# EAGLE design UART_Splitter (EAGLE 8.0.1)

## Sheet 1 of 2
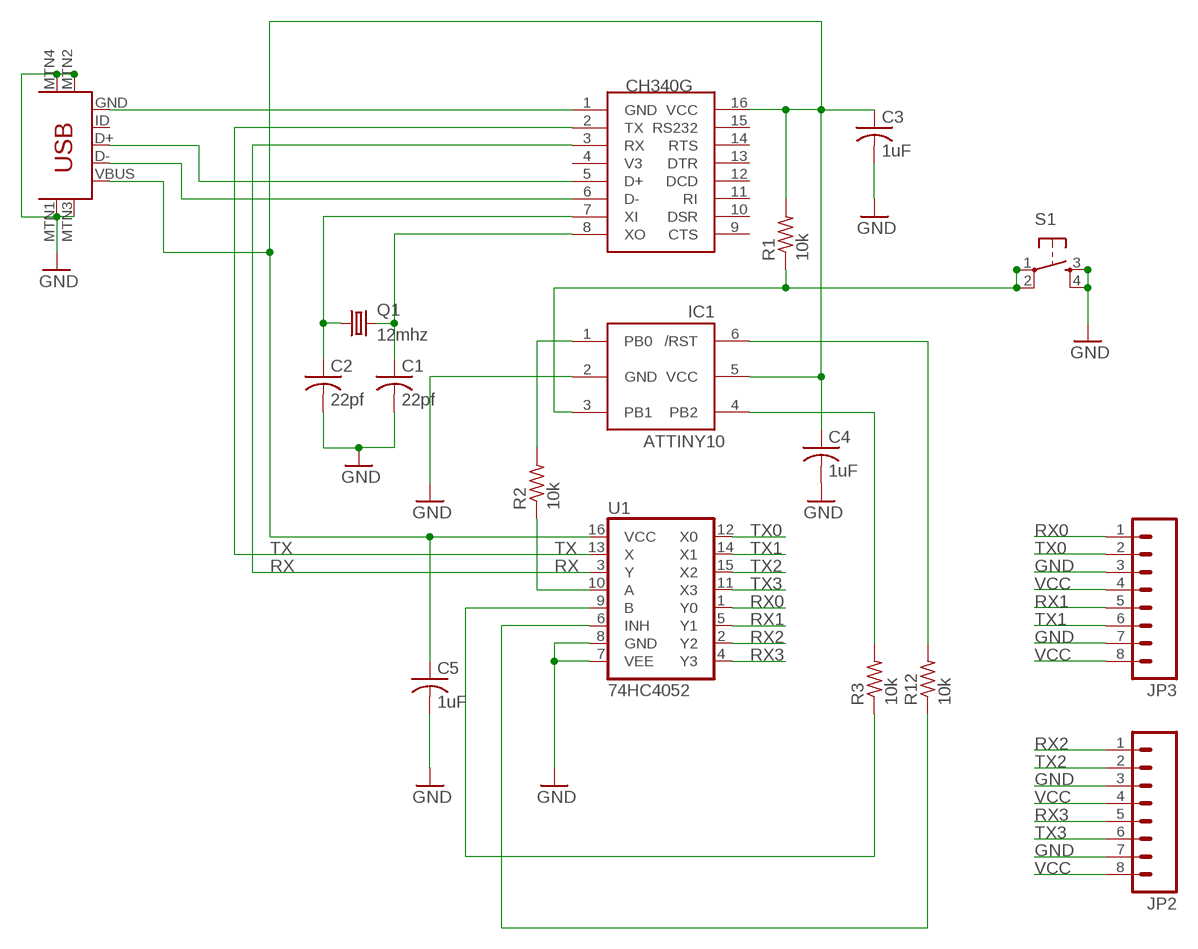
[diagram p0: schematic, sheet 1]

### Parts
C1  22pf  C-USC0402K  [C0402K]
C2  22pf  C-USC0402K  [C0402K]
C3  1uF  C-USC0402K  [C0402K]
C4  1uF  C-USC0402K  [C0402K]
C5  1uF  C-USC0402K  [C0402K]
IC1  ATTINY10  [SOT23-6]
JP2  M081X08  [1X08]
JP3  M081X08  [1X08]
Q1  12mhz  CRYSTALHC49UP  [HC49UP]
R1  10k  R-US_R0402  [R0402]
R2  10k  R-US_R0402  [R0402]
R3  10k  R-US_R0402  [R0402]
R12  10k  R-US_R0402  [R0402]
S1  TAC_SWITCHSMD  [TACTILE_SWITCH_SMD]
U1  74HC4052  74HC4052SO  [SO16]
U$1  CH340G  [SOIC16]
U$2  USB-MINIB-5PIN  [USB-MINIB]

### Nets
GND: C1.2 C2.2 C3.2 C4.2 C5.2 IC1.2(GND) JP2.3 JP2.7 JP3.3 JP3.7 S1.3 S1.4 U1.7(VEE) U1.8(GND) U$1.1(GND) U$2.GND U$2.MTN1(MTN2) U$2.MTN2(MTN3) U$2.MTN3(MTN1) U$2.MTN4
N$3: U$1.5(D+) U$2.D+
N$4: U$1.6(D-) U$2.D-
N$5: R2.1 U1.10(A)
N$6: R3.1 U1.9(B)
N$7: IC1.3(PB1) R1.1 S1.1 S1.2
N$8: IC1.6(/RST) R12.2
N$9: IC1.1(PB0) R2.2
N$10: C2.1 Q1.1 U$1.7(XI)
N$11: C1.1 Q1.2 U$1.8(XO)
N$12: IC1.4(PB2) R3.2
N$13: R12.1 U1.6(INH)
RX: U1.3(Y) U$1.3(RX)
RX0: JP3.1 U1.1(Y0) ; also sheet 2
RX1: JP3.5 U1.5(Y1) ; also sheet 2
RX2: JP2.1 U1.2(Y2) ; also sheet 2
RX3: JP2.5 U1.4(Y3) ; also sheet 2
TX: U1.13(X) U$1.2(TX)
TX0: JP3.2 U1.12(X0) ; also sheet 2
TX1: JP3.6 U1.14(X1) ; also sheet 2
TX2: JP2.2 U1.15(X2) ; also sheet 2
TX3: JP2.6 U1.11(X3) ; also sheet 2
VCC: C3.1 C4.1 C5.1 IC1.5(VCC) JP2.4 JP2.8 JP3.4 JP3.8 R1.2 U1.16(VCC) U$1.16(VCC) U$2.VBUS ; also sheet 2
Unconnected: U$1.4(V3) U$1.9(CTS) U$1.10(DSR) U$1.11(RI) U$1.12(DCD) U$1.13(DTR) U$1.14(RTS) U$1.15(RS232) U$2.ID

## Sheet 2 of 2
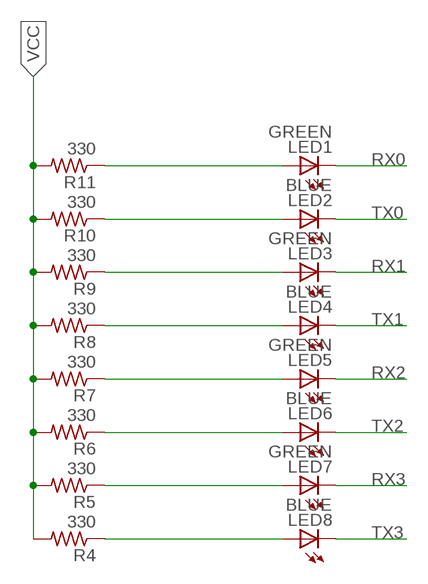
[diagram p1: schematic, sheet 2]

### Parts
LED1  GREEN  LEDSML0603  [SML0603]
LED2  BLUE  LEDSML0603  [SML0603]
LED3  GREEN  LEDSML0603  [SML0603]
LED4  BLUE  LEDSML0603  [SML0603]
LED5  GREEN  LEDSML0603  [SML0603]
LED6  BLUE  LEDSML0603  [SML0603]
LED7  GREEN  LEDSML0603  [SML0603]
LED8  BLUE  LEDSML0603  [SML0603]
R4  330  R-US_R0402  [R0402]
R5  330  R-US_R0402  [R0402]
R6  330  R-US_R0402  [R0402]
R7  330  R-US_R0402  [R0402]
R8  330  R-US_R0402  [R0402]
R9  330  R-US_R0402  [R0402]
R10  330  R-US_R0402  [R0402]
R11  330  R-US_R0402  [R0402]

### Nets
LED_RX0: LED1.A R11.1
LED_RX1: LED3.A R9.1
LED_RX2: LED5.A R7.1
LED_RX3: LED7.A R5.1
LED_TX0: LED2.A R10.1
LED_TX1: LED4.A R8.1
LED_TX2: LED6.A R6.1
LED_TX3: LED8.A R4.1
RX0: LED1.C ; also sheet 1
RX1: LED3.C ; also sheet 1
RX2: LED5.C ; also sheet 1
RX3: LED7.C ; also sheet 1
TX0: LED2.C ; also sheet 1
TX1: LED4.C ; also sheet 1
TX2: LED6.C ; also sheet 1
TX3: LED8.C ; also sheet 1
VCC: R4.2 R5.2 R6.2 R7.2 R8.2 R9.2 R10.2 R11.2 ; also sheet 1

## Library data of the parts
C1-C5 = resistor:C-US: CAPACITOR, American symbol
IC1 = adafruit:ATTINY10: ATtiny4/5/9/10 8-bit Microcontroller with 512/1024 Bytes In-System Programmable Flash
JP2 JP3 = SparkFun-Connectors:M08: Header 8 Standard 8-pin 0.1" header. Use with straight break away headers (SKU : PRT-00116), right angle break away headers (PRT-00553), swiss pins (PRT-00743), machine pins (PRT-00117), and female headers (PRT-00115).
LED1-LED8 = led:LED: LED OSRAM: - CHIPLED LG R971, LG N971, LY N971, LG Q971, LY Q971, LO R971, LY R971 LH N974, LH R974 LS Q976, LO Q976, LY Q976 LO Q996 - Hyper CHIPLED LW Q18S LB Q993, LB Q99A, LB R99A - SideLED LS A670, LO A670, LY A670, LG A670, LP A670 LB A673, LV A673, LT A673, LW A673 LH A674 LY A675 LS A676, LA A676, LO A676, LY A676, LW A676 LS A679, LY A679, LG A679 - Hyper Micro SIDELED® LS Y876, LA Y876, LO Y876, LY Y876 LT Y87S - SmartLED LW L88C, LW L88S LB L89C, LB L89S, LG L890 LS L89K, LO L89K, LY L89K LS L896, LA L896, LO L896, LY L896 - TOPLED LS T670, LO T670, LY T670, LG T670, LP T670 LSG T670, LSP T670, LSY T670, LOP T670, LYG T670 LG T671, LOG T671, LSG T671 LB T673, LV T673, LT T673, LW T673 LH T674 LS T676, LA T676, LO T676, LY T676, LB T676, LH T676, LSB T676, LW T676 LB T67C, LV T67C, LT T67C, LS T67K, LO T67K, LY T67K, LW E67C LS E67B, LA E67B, LO E67B, LY E67B, LB E67C, LV E67C, LT E67C LW T67C LS T679, LY T679, LG T679 LS T770, LO T770, LY T770, LG T770, LP T770 LB T773, LV T773, LT T773, LW T773 LH T774 LS E675, LA E675, LY E675, LS T675 LS T776, LA T776, LO T776, LY T776, LB T776 LHGB T686 LT T68C, LB T68C - Hyper Mini TOPLED® LB M676 - Mini TOPLED Santana® LG M470 LS M47K, LO M47K, LY M47K Source: http://www.osram.convergy.de LUXEON: - LUMILED® LXK2-PW12-R00, LXK2-PW12-S00, LXK2-PW14-U00, LXK2-PW14-V00 LXK2-PM12-R00, LXK2-PM12-S00, LXK2-PM14-U00 LXK2-PE12-Q00, LXK2-PE12-R00, LXK2-PE12-S00, LXK2-PE14-T00, LXK2-PE14-U00 LXK2-PB12-K00, LXK2-PB12-L00, LXK2-PB12-M00, LXK2-PB14-N00, LXK2-PB14-P00, LXK2-PB14-Q00 LXK2-PR12-L00, LXK2-PR12-M00, LXK2-PR14-Q00, LXK2-PR14-R00 LXK2-PD12-Q00, LXK2-PD12-R00, LXK2-PD12-S00 LXK2-PH12-R00, LXK2-PH12-S00 LXK2-PL12-P00, LXK2-PL12-Q00, LXK2-PL12-R00 Source: www.luxeon.com KINGBRIGHT: KA-3528ASYC Source: www.kingbright.com
Q1 = crystal:CRYSTAL: CRYSTAL; OC_FARNELL: unknown; OC_NEWARK: unknown
R1-R12 = resistor:R-US_: RESISTOR, American symbol
S1 = SparkFun-Electromechanical:TAC_SWITCH: Momentary Switch Button commonly used for reset or general input. Spark Fun Electronics SKU : COM-00097 SMT- SWCH-08247; PROD_ID: SWCH-08247
U1 = SparkFun-AnalogIC:74HC4052: Dual 4:1 analog mux; PROD_ID: IC-09813
U$1 = ch340g:CH340G
U$2 = SparkFun-Connectors:USB-MINIB: Mini-USB "B" connector with 5th pin broken out. Created new symbol breaking out 5th "ID" pin in mini/micro USB connector spec. See: http://en.wikipedia.org/wiki/Mini_usb#Cables. Uses same footprint as 4-pin symbol. Also added pins to connect to mounting / shield pads if required (probably not generally needed as signals aren't shielded once they leave the connector).

## Board
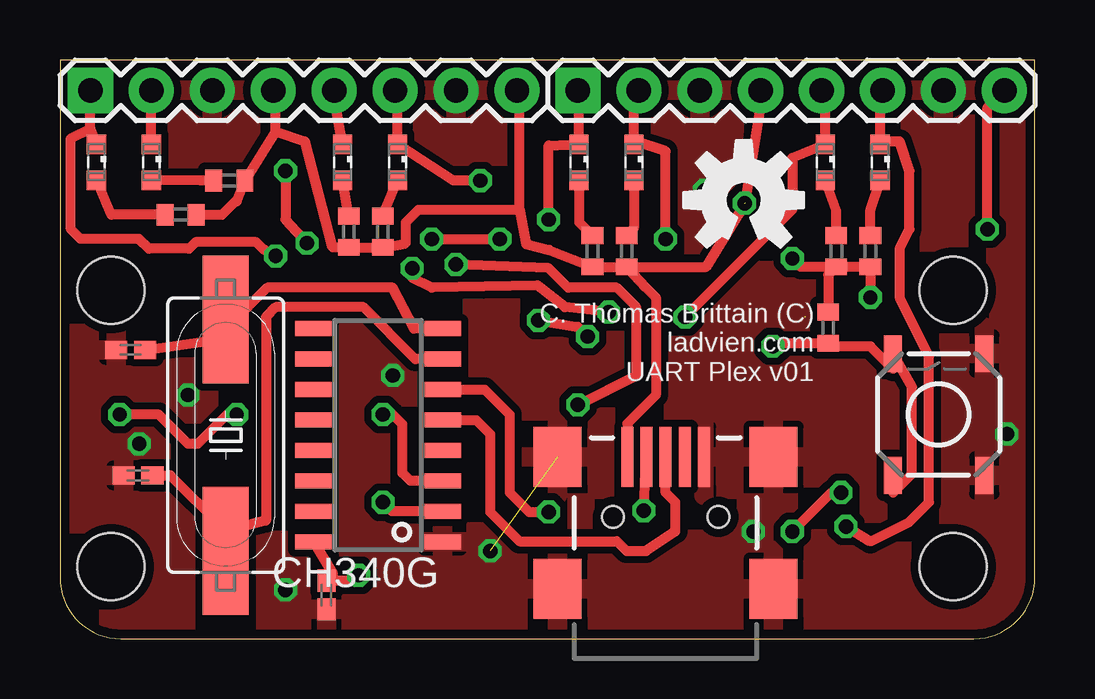
[diagram p2: board, top side]
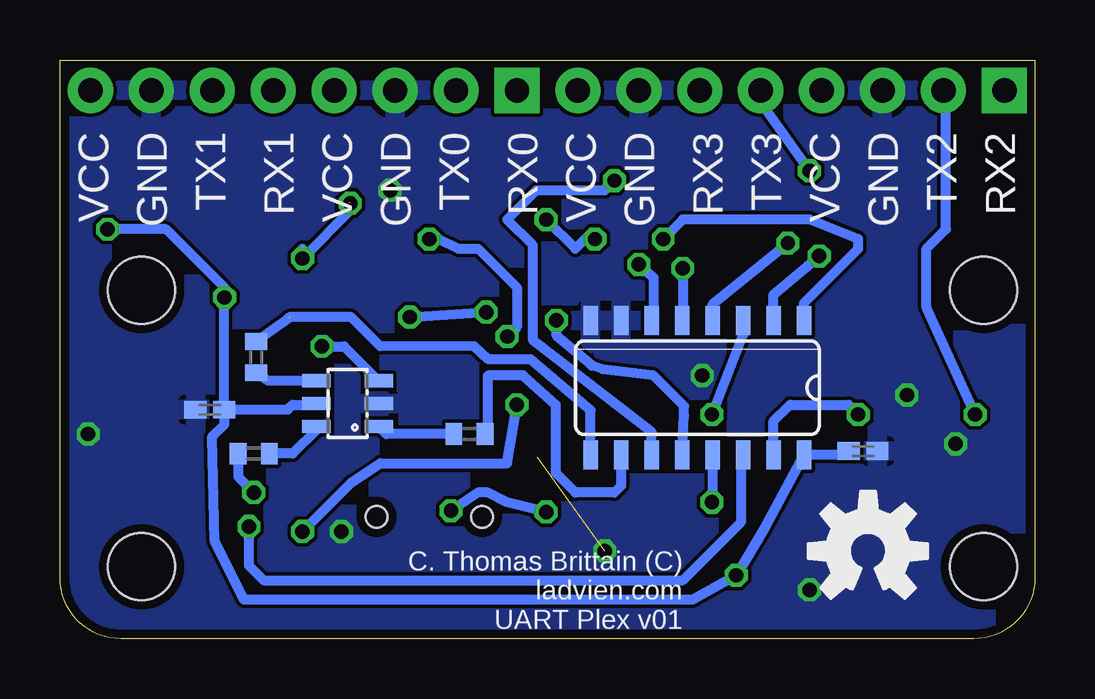
[diagram p3: board, bottom side, seen from below]

Size 40.64 x 24.13 mm. Coordinates in mm from the lower left corner, seen from the top.
Outline: 0,24.13 0,2.54 arc90 2.54,0 38.1,0 arc90 40.64,2.54 40.64,24.13 0,24.13
Copper layers (1*16): Top 0.0356mm / dielectric 1.5011mm / Bottom 0.0356mm
Design rules "oshpark-2layer *": minimum track width 6mil, minimum drill 13mil, track to track 6mil, track to pad 6mil, pad to pad 6mil, via to via 6mil, smd to smd 6mil, copper to edge 15mil, drill to drill 6mil, minimum pad ring 7mil, minimum via ring 7mil, stop-mask expansion 2.5mil, vias tented up to drill 0.6mm, thermal gap 10mil
Holes 2.79 mm at 2.13,3 37.24,3 37.24,14.53 2.13,14.53

### Footprints (pad centres in the part's own frame; a part is rotated, then mirrored left to right if it is on the bottom)
C0402K = smd 0.925 x 0.74: 1 -0.6,0; 2 0.6,0
SOT23-6 = smd 0.55 x 1.2: 1 -0.95,-1.3; 2 0,-1.3; 3 0.95,-1.3; 4 0.95,1.3; 5 0,1.3; 6 -0.95,1.3
1X08 = drill 1.016 pad 1.88 square: 1 0,0 | drill 1.016 pad 1.88: 2 2.54,0; 3 5.08,0; 4 7.62,0; 5 10.16,0; 6 12.7,0; 7 15.24,0; 8 17.78,0
SML0603 = smd 0.8 x 0.8: A 0.75,0; C -0.75,0
HC49UP = smd 5.334 x 1.93: 1 -4.826,0; 2 4.826,0
R0402 = smd 0.7 x 0.9: 1 -0.65,0; 2 0.65,0
TACTILE_SWITCH_SMD = smd 1.524 x 0.762: 1 -2.54,1.905; 2 2.54,1.905; 3 -2.54,-1.905; 4 2.54,-1.905
SO16 = smd 0.6 x 1.2: 1 -4.445,-2.8; 2 -3.175,-2.8; 3 -1.905,-2.8; 4 -0.635,-2.8; 5 0.635,-2.8; 6 1.905,-2.8; 7 3.175,-2.8; 8 4.445,-2.8; 9 4.445,2.8; 10 3.175,2.8; 11 1.905,2.8; 12 0.635,2.8; 13 -0.635,2.8; 14 -1.905,2.8; 15 -3.175,2.8; 16 -4.445,2.8
SOIC16 = smd 0.635 x 1.524: 1 -4.445,-2.695; 2 -3.175,-2.695; 3 -1.905,-2.695; 4 -0.635,-2.695; 5 0.635,-2.695; 6 1.905,-2.695; 7 3.175,-2.695; 8 4.445,-2.695; 9 4.445,2.695; 10 3.175,2.695; 11 1.905,2.695; 12 0.635,2.695; 13 -0.635,2.695; 14 -1.905,2.695; 15 -3.175,2.695; 16 -4.445,2.695
USB-MINIB = smd 2.5 x 0.5: D+ 2.5,0; D- 2.5,0.8; GND 2.5,-1.6; ID 2.5,-0.8; VBUS 2.5,1.6 | smd 2.5 x 2: MTN1 -3,4.5; MTN2 2.5,4.5; MTN3 -3,-4.5; MTN4 2.5,-4.5 | hole 0.9: 0,2.2; 0,-2.2

### Placement (x,y rotation side)
C1  2.95,12.04 180 top
C2  3.25,6.81 180 top
C3  11.11,1.82 270 top
C4  34.39,9.55 180 bottom
C5  7.16,7.82 0 bottom
IC1  28.65,9.8 90 bottom
JP2  1.27,22.86 0 top
JP3  21.59,22.86 0 top
LED1  21.64,19.86 270 top
LED2  23.93,19.86 270 top
LED3  31.9,19.86 270 top
LED4  34.19,19.86 270 top
LED5  1.52,19.86 270 top
LED6  3.81,19.86 270 top
LED7  11.79,19.86 270 top
LED8  14.07,19.86 270 top
Q1  6.91,8.48 90 top
R1  32.02,12.96 90 top
R2  23.57,8.53 180 bottom
R3  32.46,11.73 270 bottom
R4  13.46,16.97 270 top
R5  12.04,16.97 270 top
R6  7.06,19.1 0 top
R7  5.03,17.68 0 top
R8  33.78,16.15 270 top
R9  32.36,16.15 270 top
R10  23.62,16.15 270 top
R11  22.2,16.15 270 top
R12  32.56,7.72 0 bottom
S1  36.63,9.35 90 top
U1  14.07,10.46 180 bottom
U$1  13.26,8.48 90 top
U$2  25.25,5.08 90 top
U$3  [OSHW-LOGO-M]  28.5,18.29 0 top
U$4  [OSHW-LOGO-M]  6.96,3.66 0 bottom

### Tracks (layer width: path | path; a pad name or v marks a point on that pad's centre or on a via)
GND  (via drill 0.6)  (1 unrouted)
  other vias: 3.3,8.13 28.91,4.47 39.47,8.53 26.87,18.69 5.33,10.16 17.93,3.66 9.4,2.03 13.87,10.97
  pour Top (isolate 0.305): 0,24.13 0,-1.22 40.64,-1.22 40.64,24.13
  pour Bottom: 0,24.13 0,-1.22 40.64,-1.22 40.64,24.13
LED_RX0
  Top 0.406: LED1.A 21.64,17.36 R11.1
LED_RX1
  Top 0.406: R9.1 32.36,17.84 LED3.A
LED_RX2
  Top 0.406: R7.1 2.15,17.68 LED5.A
LED_RX3
  Top 0.406: R5.1 12.04,17.64 LED7.A
LED_TX0
  Top 0.406: LED2.A 23.93,17.11 R10.1
LED_TX1
  Top 0.406: R8.1 33.78,17.89 LED4.A
LED_TX2
  Top 0.406: R6.1 5.85,19.1 LED6.A
LED_TX3
  Top 0.406: R4.1 13.46,17.69 LED8.A
N$3
  Top 0.406: U$1.5 17.35,9.12 17.93,8.53 17.93,5.28 19.15,4.06 23.22,4.06 23.62,3.66 24.44,3.66 25.65,4.47 25.65,5.69 25.25,6.1 U$2.D+
N$4  (via drill 0.6)
  Top 0.406: U$1.6 17.7,10.39 18.74,9.35 18.74,6.1 19.56,5.28 v20.37,5.28 | v24.34,5.33 24.44,7.57 U$2.D-
  Bottom 0.406: v20.37,5.28 22,5.69 22.81,6.1 23.22,6.1 v24.34,5.33
N$5
  Bottom 0.406: U1.10 17.25,6.38 17.53,6.1 19.15,6.1 19.96,6.91 19.96,9.75 21.34,10.98 22.81,10.97 22.81,8.65 R2.1
N$6  (1 unrouted)
  Bottom 0.406: 31.03,13.41 R3.1 | 31.24,13.26 31.09,13.41 28.5,13.41 27.28,12.19 23.37,12.2 22.77,11.65 21.02,11.65 18.52,9.53 U1.9
N$7  (via drill 0.6)
  Top 0.406: S1.1 34.72,6.08 35.5,6.87 35.5,10.46 35.52,10.48 S1.2 34.72,11.25 33.78,12.19 32.14,12.19 R1.1 29.84,12.31 v29.72,12.19
  Bottom 0.406: v29.72,12.19 28.79,12.19 IC1.3
N$8
  Bottom 0.406: IC1.6 29.95,8.71 30.94,7.72 R12.2
N$9
  Bottom 0.406: R2.2 27.03,8.53 IC1.1
N$10
  Top 0.406: 6.93,4.49 Q1.1 6.96,3.3 | 6.74,4.67 6.93,4.49 | 6.74,4.67 6.51,4.88 | 6.93,4.49 8.59,4.92 8.59,13.41 8.99,13.82 12.65,13.82 14.81,11.66 U$1.7 | C2.1 4.6,6.81 6.74,4.67
N$11
  Top 0.406: C1.1 6.45,12.45 Q1.2 7.82,13.82 8.64,14.63 13.87,14.63 14.76,12.93 U$1.8
N$12
  Bottom 0.406: IC1.4 31.95,10.75 R3.2
N$13  (via drill 0.6)
  Top 0.406: v32.56,6.1 32.16,6.1 v30.53,4.47 | v21.59,9.75 24.03,10.97 24.03,13.82 23.22,14.63 21.18,14.63 20.37,15.44 v16.51,15.61
  Bottom 0.406: R12.1 33.21,6.75 v32.56,6.1 | v30.53,4.47 28.5,6.5 27.28,7.32 22,7.32 v21.59,9.75 | v16.51,15.61 15.9,15.04 15.9,13.34 U1.6
RX  (via drill 0.6)
  Top 0.406: U$1.3 14.6,6.58 14.27,6.91 14.27,8.94 13.87,9.35 v13.46,9.35
  Bottom 0.406: U1.3 12.17,12.68 v13.46,9.35
RX0  (via drill 0.6)
  Top 0.406: JP3.1 21.64,22.81 LED1.C 20.37,20.56 v20.37,17.48 | v15.49,16.66 v18.34,16.66
  Bottom 0.406: U1.1 9.63,13.99 7.37,16.26 7.37,16.66 9.4,17.48 14.68,17.48 v15.49,16.66 | v20.37,17.48 19.15,16.26 18.74,16.66 v18.34,16.66
RX1  (via drill 0.6)
  Top 0.406: JP3.5 31.9,22.71 LED3.C 30.53,20.05 30.53,17.88 v26.06,13.41 | v22.88,13.61 21.05,13.82 19.9,14.73 15.49,14.63 14.68,15.04 v14.68,15.44
  Bottom 0.406: v26.06,13.41 v22.88,13.61 | v14.68,15.44 14.68,13.29 U1.5
RX2  (via drill 0.6)
  Top 0.406: 1.27,21.27 JP2.1 | 1.27,21.27 LED5.C | v8.99,15.96 8.47,16.24 8.19,16.53 5.65,16.53 5.38,16.26 3.71,16.26 3.3,16.66 0.86,16.66 0.46,17.07 0.46,20.87 1.27,21.27
  Bottom 0.406: U1.2 10.9,14.35 v8.99,15.96
RX3  (via drill 0.6)
  Top 0.406: LED7.C 11.38,22.81 JP2.5 | v9.4,19.51 9.4,17.48 v10.3,16.49
  Bottom 0.406: U1.4 13.44,13.95 v10.3,16.49 | JP2.5 11.43,22.35 v9.4,19.51
TX  (via drill 0.6)
  Top 0.406: U$1.2 13.84,5.31 v13.46,5.69
  Bottom 0.406: U1.13 13.44,6.53 v13.46,5.69
TX0  (via drill 0.6)
  Top 0.406: JP3.2 23.93,22.66 LED2.C 24.04,20.73 25.25,20.32 v25.25,16.66 | v19.95,13.27 21.59,13.01 v22,12.6
  Bottom 0.406: U1.12 14.62,9.29 14.62,9.7 15.9,10.97 18.01,11.23 18.47,11.39 19.94,12.62 v19.95,13.27 | v25.25,16.66 24.84,16.66 24.03,16.26 23.22,16.26 21.59,14.63 21.59,13.01 v22,12.6
TX1  (via drill 0.6)
  Top 0.406: JP3.6 34.19,22.76 LED4.C 34.3,20.73 35,20.73 35.41,19.51 35.41,17.07 35,16.26 35,14.22 36.22,11.79 36.22,5.69 35.41,4.88 33.78,4.06 v32.77,4.67
  Bottom 0.406: 32.97,4.47 v32.77,4.67 32.77,3.05 32.16,2.44 14.68,2.44 12.24,4.88 12.24,7.59 U1.14
TX2  (via drill 0.6)
  Top 0.406: LED6.C JP2.2 | v7.37,9.35 6.96,9.35 5.74,8.13 5.33,8.13 4.12,9.35 v2.49,9.35
  Bottom 0.406: JP2.2 3.71,22.76 3.71,17.07 4.52,16.26 4.52,13.82 v2.49,9.35 | U1.15 10.9,9.07 10.21,9.75 7.77,9.75 v7.37,9.35
TX3  (via drill 0.6)
  Top 0.406: JP2.6 14.07,22.76 LED8.C 16.4,19.1 v17.53,19.1
  Bottom 0.406: U1.11 15.98,8.61 20.92,12.43 20.93,16.41 22,17.48 20.78,18.69 17.93,18.69 v17.53,19.1
VCC  (via drill 0.6)  (1 unrouted)
  Top 0.406: 8.99,21.13 8.99,22.76 JP2.4 | 8.99,21.13 10.21,20.73 11.37,16.32 R5.2 R4.2 13.52,16.32 14.39,16.48 14.42,16.51 14.42,17.36 14.94,17.88 17.93,17.88 19.15,17.89 | R10.2 R11.2 20.39,16.21 19.43,16.44 19.15,17.89 | 19.15,17.89 19.15,22.76 JP2.8 | R10.2 26.93,15.5 28.57,18.19 29.31,22.76 JP3.4 | R9.2 R8.2 v33.78,14.22 | U$2.VBUS 23.65,8.97 24.84,10.16 24.84,14.22 24.44,14.63 23.65,15.48 R10.2 | R1.2 32.02,15.17 R9.2 | R7.2 6.76,17.68 7.37,18.29 7.37,18.23 R6.2 8.99,21.13 | v38.66,17.07 38.66,22.15 JP3.8 | v30.53,15.85 30.88,15.5 R9.2 | U$1.16 11.38,2.69 C3.1 12.23,2.42 v12.45,2.64
  Bottom 0.406: v38.66,17.07 36.22,17.07 33.78,14.63 v33.78,14.22 33.79,14.21 C4.1 | 30.53,16.26 v30.53,15.85 28.54,17.84 v28.54,18.15 | C4.1 31.14,9.55 30.94,9.75 30,9.75 IC1.5 | C5.1 7.92,7.67 U1.16 11.25,4.65 v12.45,2.64 14.27,1.63 32.97,1.63 34.19,4.06 34.29,8.4 34.29,8.43 33.78,8.94 C4.1

### Text on the board
tNames: C. Thomas Brittain (C) / ladvien.com / UART Plex v01
bNames: RX2 | TX2 | GND | VCC | TX3 | RX3 | GND | VCC | RX0 | TX0 | GND | VCC | RX1 | TX1 | GND | VCC | C. Thomas Brittain (C) / ladvien.com / UART Plex v01